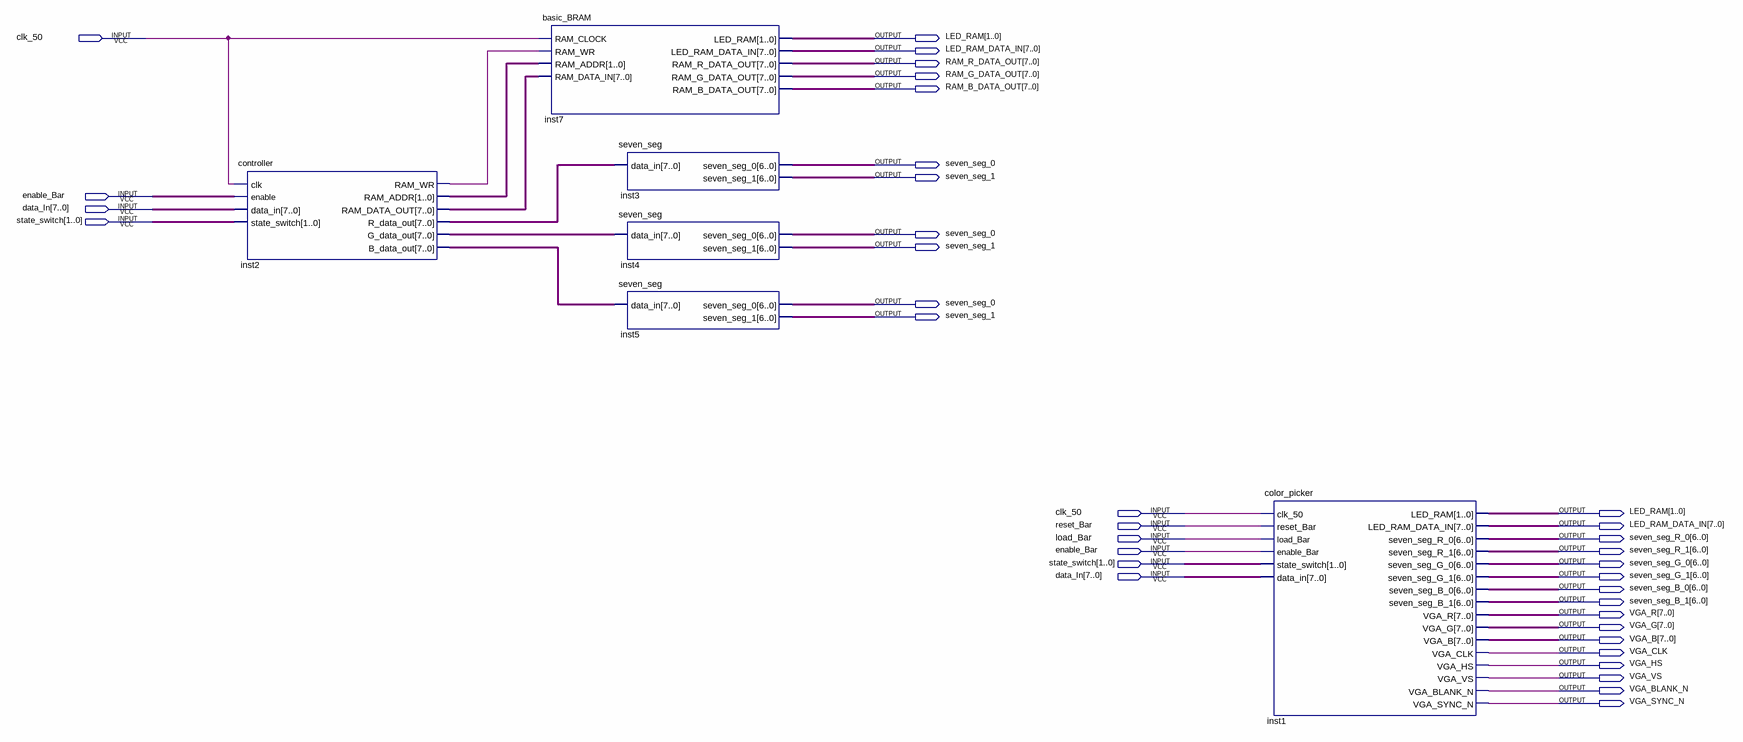
[diagram p0: schematic sheet]
// Quartus schematic VGA_ColorPicker.bdf as structural Verilog: 6 symbols, 37 pins
module VGA_ColorPicker (
  input  clk_50,
  input  enable_Bar,
  input  [7:0] data_In,
  input  [1:0] state_switch,
  input  reset_Bar,
  input  load_Bar,
  output [1:0] LED_RAM,
  output [7:0] LED_RAM_DATA_IN,
  output [7:0] RAM_R_DATA_OUT,
  output [7:0] RAM_G_DATA_OUT,
  output [7:0] RAM_B_DATA_OUT,
  output seven_seg_0,
  output seven_seg_1,
  output [6:0] seven_seg_R_0,
  output [6:0] seven_seg_R_1,
  output [6:0] seven_seg_G_0,
  output [6:0] seven_seg_G_1,
  output [6:0] seven_seg_B_0,
  output [6:0] seven_seg_B_1,
  output [7:0] VGA_R,
  output [7:0] VGA_G,
  output [7:0] VGA_B,
  output VGA_CLK,
  output VGA_HS,
  output VGA_VS,
  output VGA_BLANK_N,
  output VGA_SYNC_N
);

  wire inst2_ram_wr;
  wire [1:0] inst2_ram_addr;
  wire [6:0] inst3_seven_seg_0, inst3_seven_seg_1, inst4_seven_seg_0, inst4_seven_seg_1, inst5_seven_seg_0,
       inst5_seven_seg_1;
  wire [7:0] inst2_b_data_out, inst2_g_data_out, inst2_r_data_out, inst2_ram_data_out;

  controller inst2 (
    .clk(clk_50), .enable(enable_Bar), .data_in(data_In), .state_switch(state_switch), .RAM_WR(inst2_ram_wr),
    .RAM_ADDR(inst2_ram_addr), .RAM_DATA_OUT(inst2_ram_data_out), .R_data_out(inst2_r_data_out),
    .G_data_out(inst2_g_data_out), .B_data_out(inst2_b_data_out));
  basic_BRAM inst7 (
    .RAM_CLOCK(clk_50), .RAM_WR(inst2_ram_wr), .RAM_ADDR(inst2_ram_addr), .RAM_DATA_IN(inst2_ram_data_out),
    .LED_RAM(LED_RAM), .LED_RAM_DATA_IN(LED_RAM_DATA_IN), .RAM_R_DATA_OUT(RAM_R_DATA_OUT),
    .RAM_G_DATA_OUT(RAM_G_DATA_OUT), .RAM_B_DATA_OUT(RAM_B_DATA_OUT));
  seven_seg inst3 (.data_in(inst2_r_data_out), .seven_seg_0(inst3_seven_seg_0), .seven_seg_1(inst3_seven_seg_1));
  seven_seg inst4 (.data_in(inst2_g_data_out), .seven_seg_0(inst4_seven_seg_0), .seven_seg_1(inst4_seven_seg_1));
  seven_seg inst5 (.data_in(inst2_b_data_out), .seven_seg_0(inst5_seven_seg_0), .seven_seg_1(inst5_seven_seg_1));
  color_picker inst1 (
    .clk_50(clk_50), .reset_Bar(reset_Bar), .load_Bar(load_Bar), .enable_Bar(enable_Bar),
    .state_switch(state_switch), .data_in(data_In), .LED_RAM(LED_RAM), .LED_RAM_DATA_IN(LED_RAM_DATA_IN),
    .seven_seg_R_0(seven_seg_R_0), .seven_seg_R_1(seven_seg_R_1), .seven_seg_G_0(seven_seg_G_0),
    .seven_seg_G_1(seven_seg_G_1), .seven_seg_B_0(seven_seg_B_0), .seven_seg_B_1(seven_seg_B_1),
    .VGA_R(VGA_R), .VGA_G(VGA_G), .VGA_B(VGA_B), .VGA_CLK(VGA_CLK), .VGA_HS(VGA_HS), .VGA_VS(VGA_VS),
    .VGA_BLANK_N(VGA_BLANK_N), .VGA_SYNC_N(VGA_SYNC_N));
endmodule
